# EAGLE board tarjeta-v7 (EAGLE 6.4)
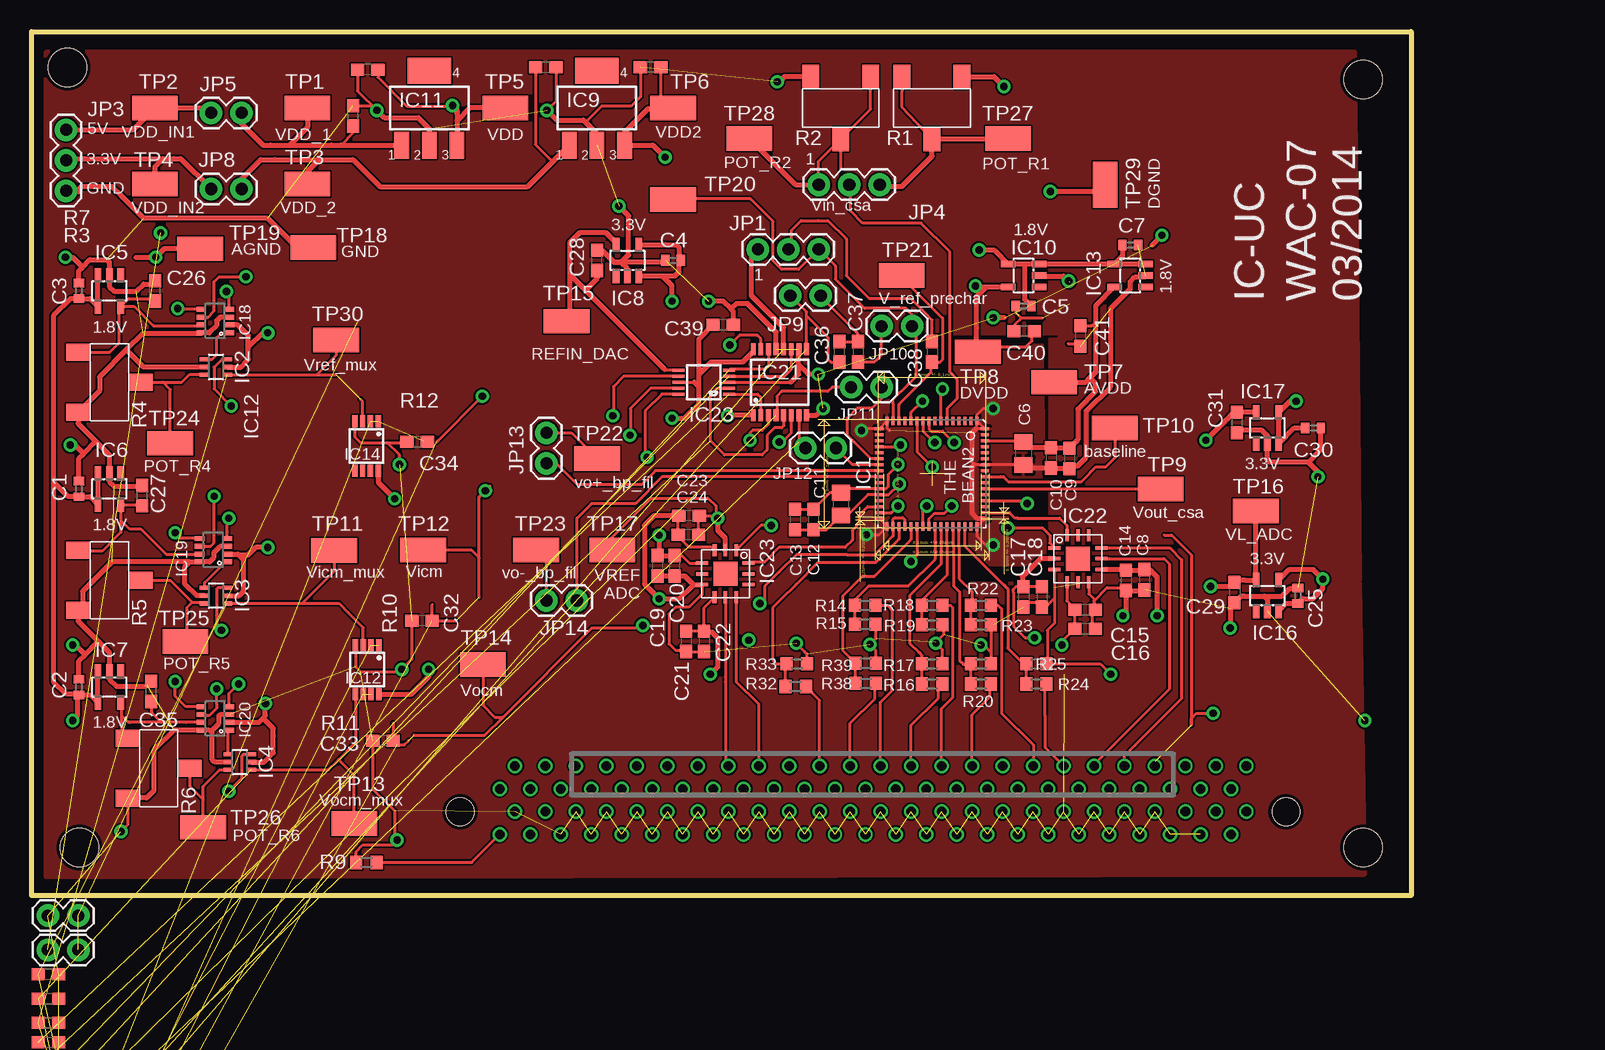
[diagram p5: board, top side]
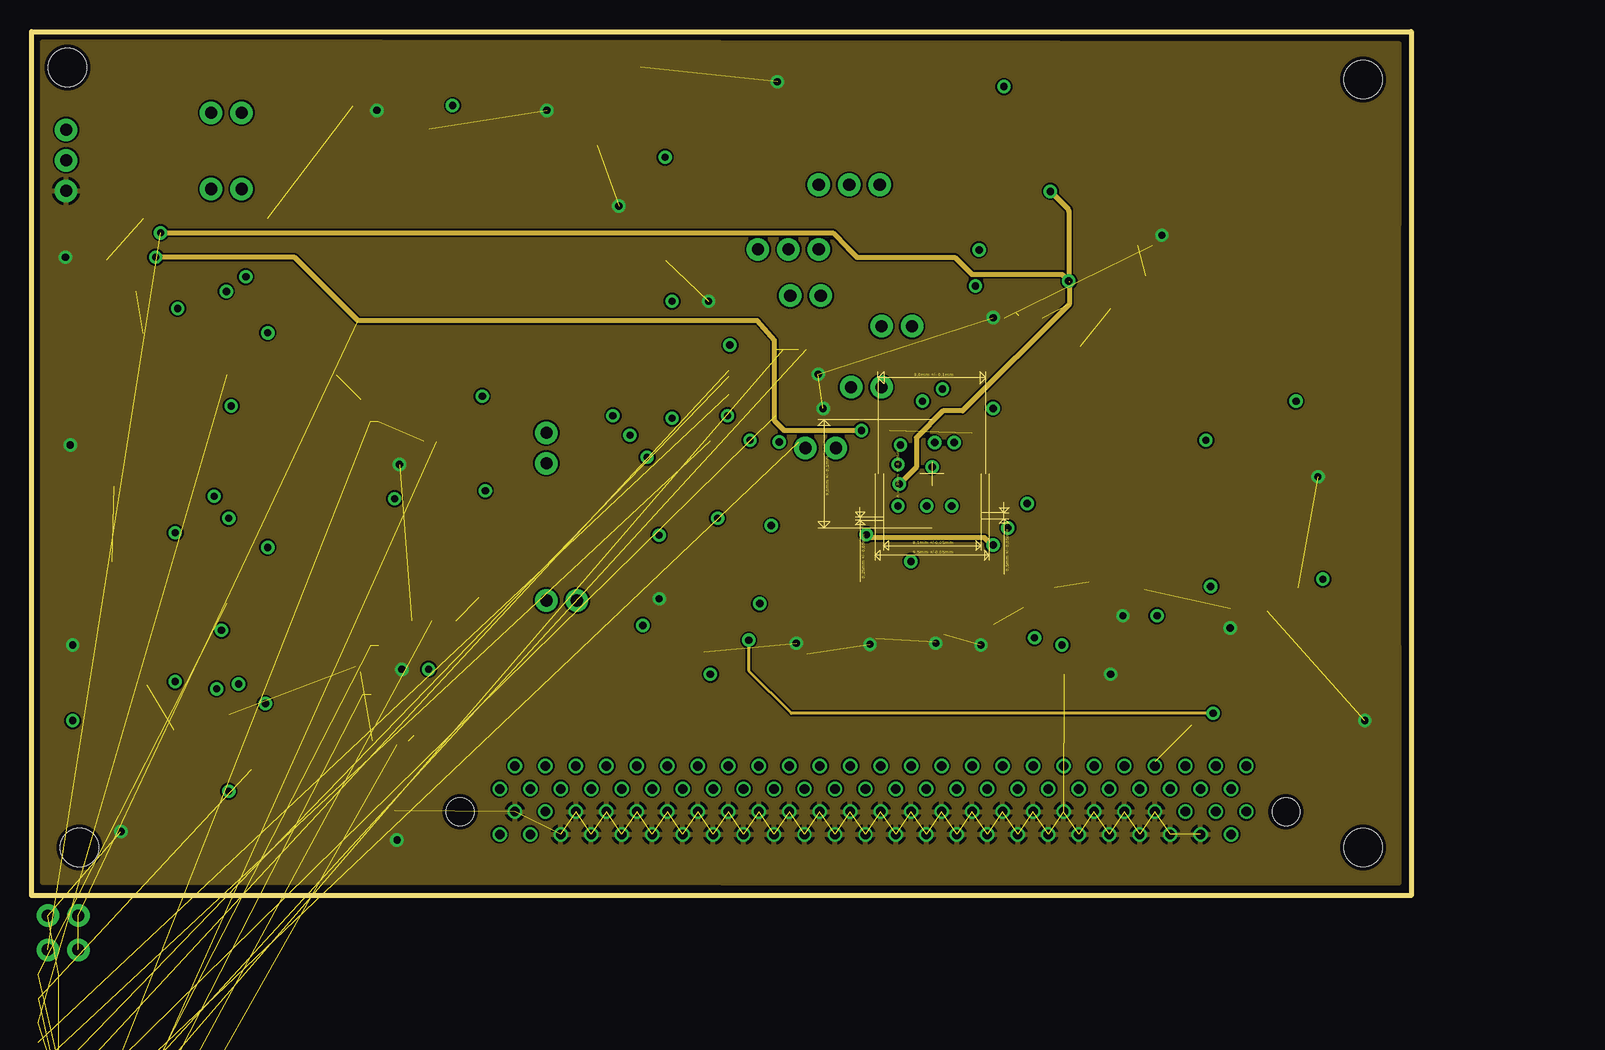
[diagram p6: board, inner layer Route2]
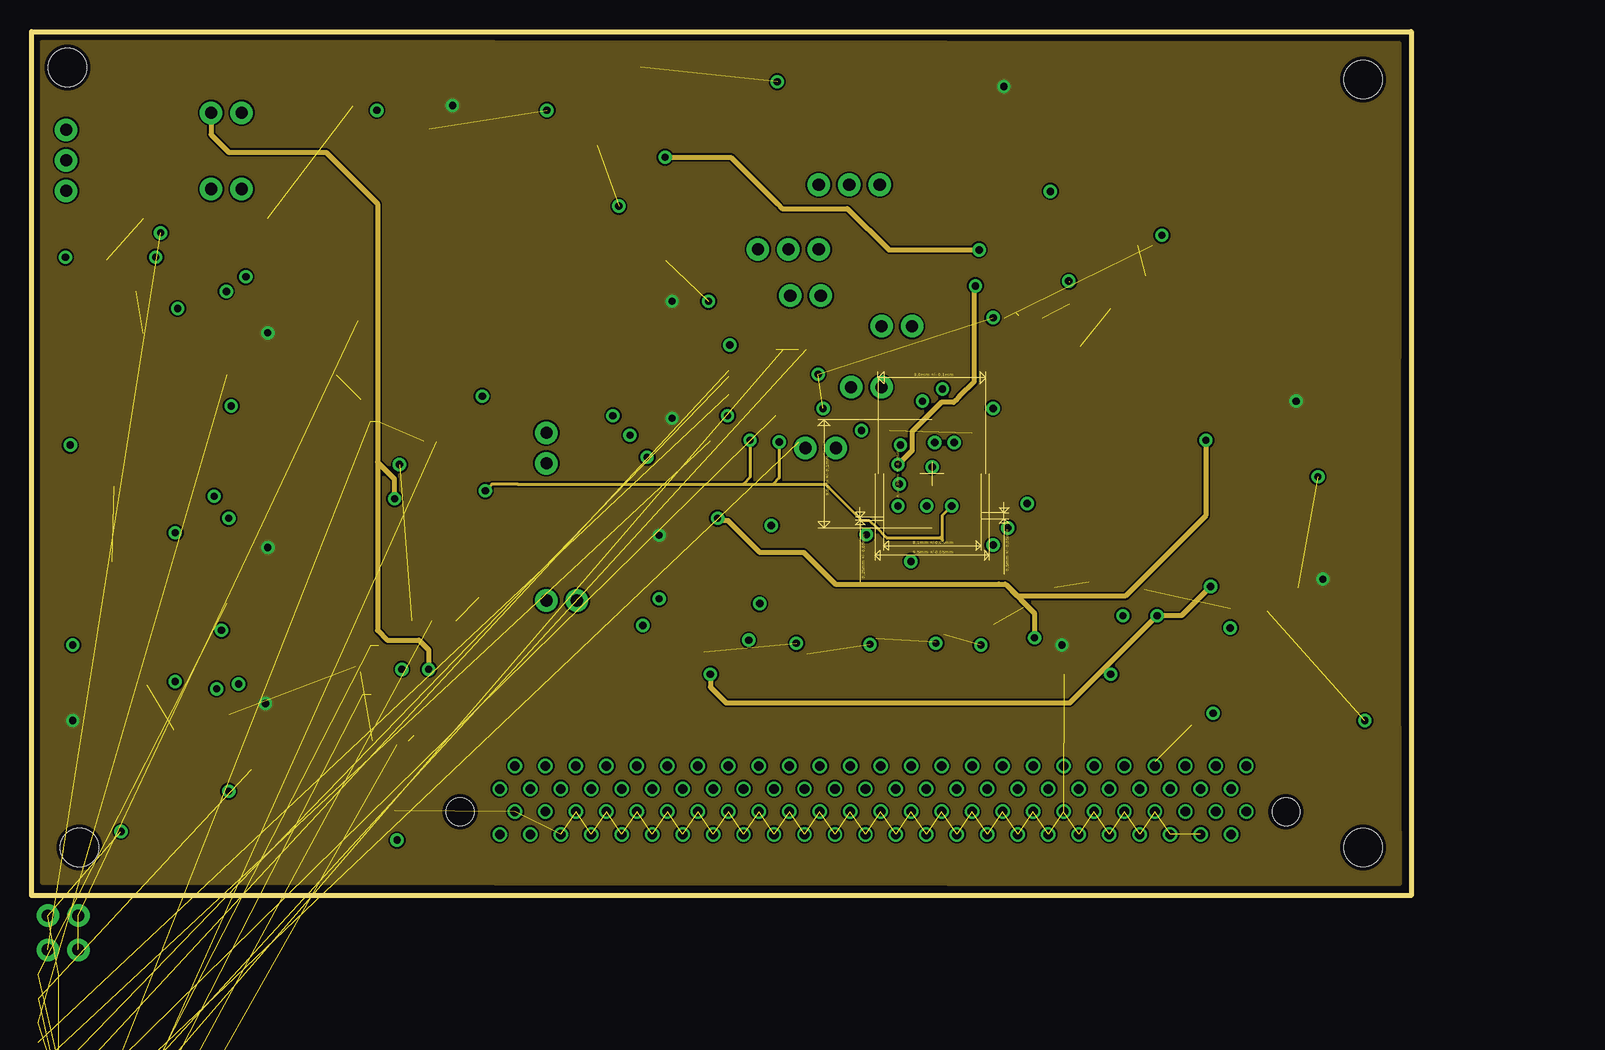
[diagram p7: board, inner layer Route3]
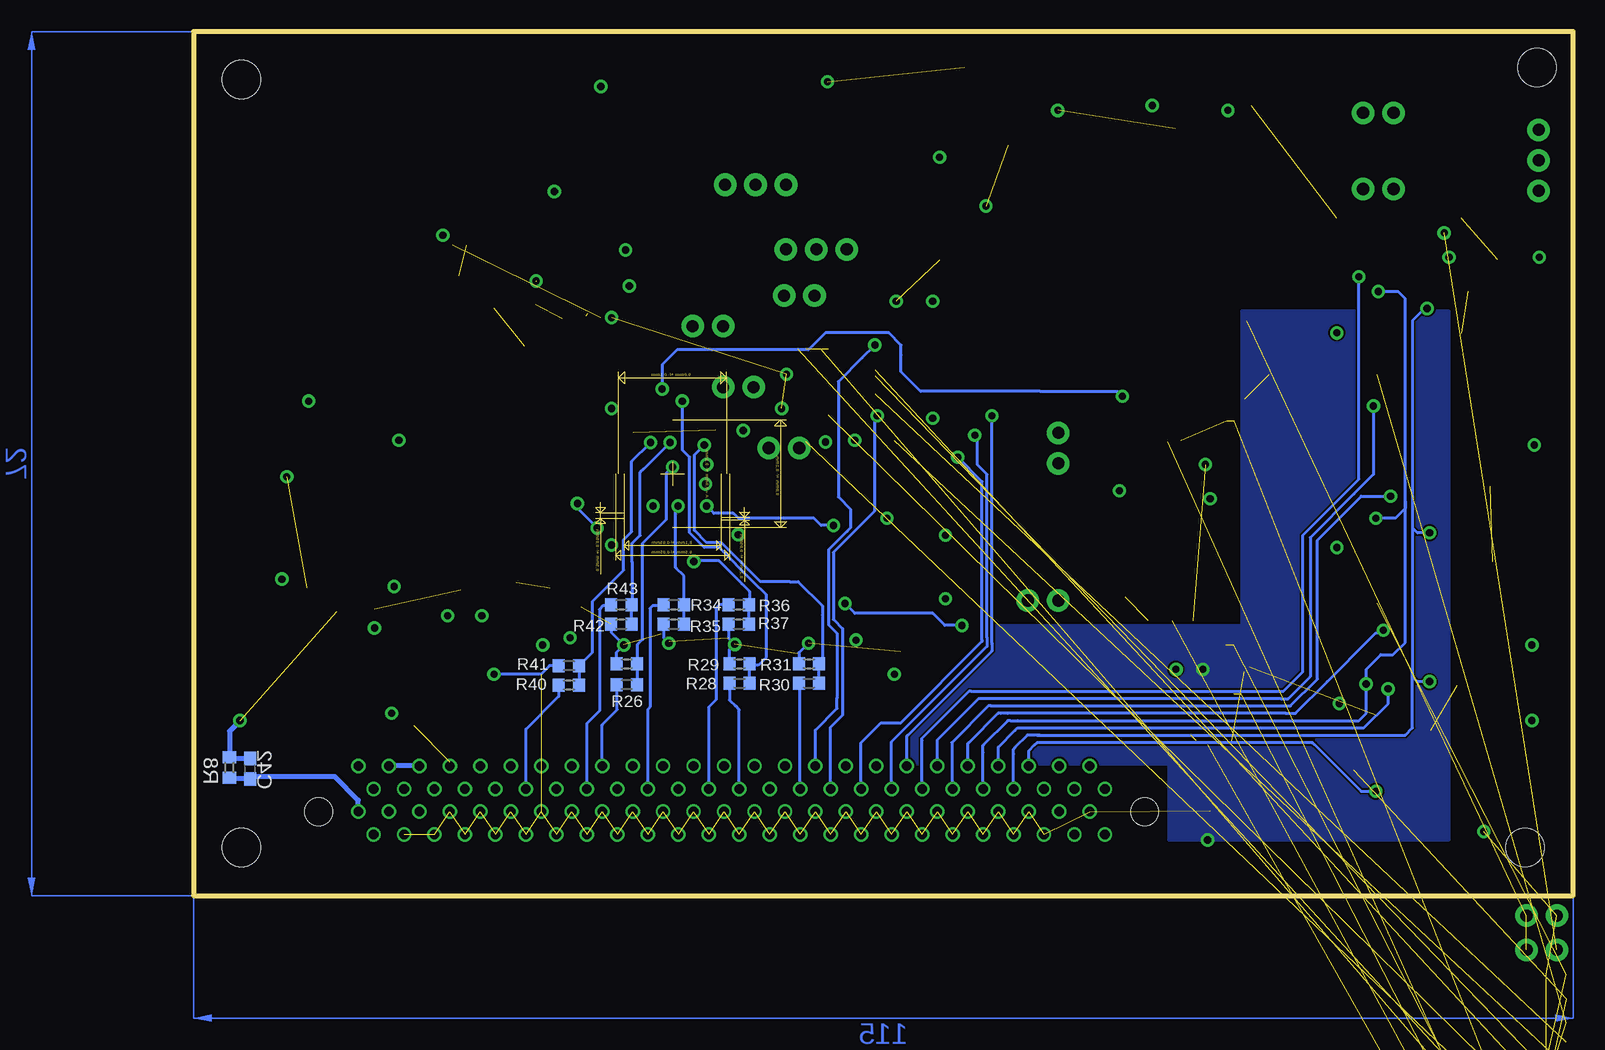
[diagram p8: board, bottom side, seen from below]

Size 115 x 72 mm. Coordinates in mm from the lower left corner, seen from the top.
Outline: 0,0 0,72 115,72 115,0 0,0
Copper layers [2:(1*2*3*16):3]: Top 0.035mm / dielectric 0.2mm / Route2 0.035mm / dielectric 0.8mm / Route3 0.035mm / dielectric 0.2mm / Bottom 0.035mm
Design rules "Reglas *": minimum track width 8mil, minimum drill 20mil, track to track 6mil, track to pad 6mil, pad to pad 6mil, via to via 6mil, smd to smd 6mil, copper to edge 12mil, drill to drill 8mil, minimum pad ring 6mil, minimum via ring 10mil, stop-mask expansion 4mil, vias tented up to drill 25mil, thermal gap 10mil
Holes 3.2 mm at 111,4 111,68 3,69 4,4

## Footprints (pad centres in the part's own frame; a part is rotated, then mirrored left to right if it is on the bottom)
C0402 = smd 0.7 x 0.9: 1 -0.65,0; 2 0.65,0
C0805 = smd 1.3 x 1.5: 1 -0.95,0; 2 0.95,0
C0603 = smd 1.1 x 1: 1 -0.85,0; 2 0.85,0
QFN64 = smd 0.7 x 0.25: 1 -14.56,5.02; 2 -14.56,4.52; 3 -14.56,4.02; 4 -14.56,3.52; 5 -14.56,3.02; 6 -14.56,2.52; 7 -14.56,2.02; 8 -14.56,1.52; 9 -14.56,1.02; 10 -14.56,0.52; 11 -14.56,0.02; 12 -14.56,-0.48; 13 -14.56,-0.98; 14 -14.56,-1.48; 15 -14.56,-1.98; 16 -14.56,-2.48; 33 -5.76,-2.48; 34 -5.76,-1.98; 35 -5.76,-1.48; 36 -5.76,-0.98; 37 -5.76,-0.48; 38 -5.76,0.02; 39 -5.76,0.52; 40 -5.76,1.02; 41 -5.76,1.52; 42 -5.76,2.02; 43 -5.76,2.52; 44 -5.76,3.02; 45 -5.76,3.52; 46 -5.76,4.02; 47 -5.76,4.52; 48 -5.76,5.02 | smd 0.25 x 0.7: 17 -13.91,-3.13; 18 -13.41,-3.13; 19 -12.91,-3.13; 20 -12.41,-3.13; 21 -11.91,-3.13; 22 -11.41,-3.13; 23 -10.91,-3.13; 24 -10.41,-3.13; 25 -9.91,-3.13; 26 -9.41,-3.13; 27 -8.91,-3.13; 28 -8.41,-3.13; 29 -7.91,-3.13; 30 -7.41,-3.13; 31 -6.91,-3.13; 32 -6.41,-3.13; 49 -6.41,5.67; 50 -6.91,5.67; 51 -7.41,5.67; 52 -7.91,5.67; 53 -8.41,5.67; 54 -8.91,5.67; 55 -9.41,5.67; 56 -9.91,5.67; 57 -10.41,5.67; 58 -10.91,5.67; 59 -11.41,5.67; 60 -11.91,5.67; 61 -12.41,5.67; 62 -12.91,5.67; 63 -13.41,5.67; 64 -13.91,5.67
SC70 = smd 0.35 x 0.8: 1 -0.65,-0.95; 2 0,-0.95; 3 0.65,-0.95; 4 0.65,0.95; 5 0,0.95; 6 -0.65,0.95
SOT23-5L_2 = smd 0.55 x 1.2: 1 -0.95,-1.3; 2 0,-1.3; 3 0.95,-1.3; 4 0.95,1.3; 5 -0.95,1.3
SOT223 = smd 1.219 x 2.235: 1 -2.311,-3.099; 2 0,-3.099; 3 2.311,-3.099 | smd 3.6 x 2.2: 4 0,3.099
MSOP8 = smd 0.45 x 1: 1 -1.175,-1.875; 2 -0.525,-1.875; 3 0.125,-1.875; 4 0.775,-1.875; 5 0.775,2.225; 6 0.125,2.225; 7 -0.525,2.225; 8 -1.175,2.225
SOT23-8_2 = smd 0.406 x 0.813: 1 -1,-1.04; 2 -0.35,-1.04; 3 0.3,-1.04; 4 0.95,-1.04; 5 0.95,1.26; 6 0.3,1.26; 7 -0.35,1.26; 8 -1,1.26
QSOP16 = smd 0.4 x 1: 1 -2.223,-2.75; 2 -1.588,-2.75; 3 -0.953,-2.75; 4 -0.318,-2.75; 5 0.318,-2.75; 6 0.953,-2.75; 7 1.588,-2.75; 8 2.223,-2.75; 9 2.223,2.75; 10 1.588,2.75; 11 0.953,2.75; 12 0.318,2.75; 13 -0.318,2.75; 14 -0.953,2.75; 15 -1.588,2.75; 16 -2.223,2.75
TQFN12 = smd 1 x 0.3: P$1 0.05,-1.1; P$2 0.05,-2; P$3 0.05,-2.9; P$7 3.95,-2.9; P$8 3.95,-2; P$9 3.95,-1.1 | smd 0.3 x 1: P$4 1.1,-3.95; P$5 2,-3.95; P$6 2.9,-3.95; P$10 2.9,-0.05; P$11 2,-0.05; P$12 1.1,-0.05 | smd 2 x 2: P$13 2,-2
MSOP10 = smd 0.25 x 1: 1 -1,-2.113; 2 -0.5,-2.113; 3 0,-2.113; 4 0.5,-2.113; 5 1,-2.113; 6 1,2.113; 7 0.5,2.113; 8 0,2.113; 9 -0.5,2.113; 10 -1,2.113
FX2-100S-1.27 = drill 0.8: A1 0,0; A2 -1.27,-1.905; A3 -2.54,0; A4 -3.81,-1.905; A5 -5.08,0; A6 -6.35,-1.905; A7 -7.62,0; A8 -8.89,-1.905; A9 -10.16,0; A10 -11.43,-1.905; A11 -12.7,0; A12 -13.97,-1.905; A13 -15.24,0; A14 -16.51,-1.905; A15 -17.78,0; A16 -19.05,-1.905; A17 -20.32,0; A18 -21.59,-1.905; A19 -22.86,0; A20 -24.13,-1.905; A21 -25.4,0; A22 -26.67,-1.905; A23 -27.94,0; A24 -29.21,-1.905; A25 -30.48,0; A26 -31.75,-1.905; A27 -33.02,0; A28 -34.29,-1.905; A29 -35.56,0; A30 -36.83,-1.905; A31 -38.1,0; A32 -39.37,-1.905; A33 -40.64,0; A34 -41.91,-1.905; A35 -43.18,0; A36 -44.45,-1.905; A37 -45.72,0; A38 -46.99,-1.905; A39 -48.26,0; A40 -49.53,-1.905; A41 -50.8,0; A42 -52.07,-1.905; A43 -53.34,0; A44 -54.61,-1.905; A45 -55.88,0; A46 -57.15,-1.905; A47 -58.42,0; A48 -59.69,-1.905; A49 -60.96,0; A50 -62.23,-1.905; B1 0,3.8; B2 -1.27,1.895; B3 -2.54,3.8; B4 -3.81,1.895; B5 -5.08,3.8; B6 -6.35,1.895; B7 -7.62,3.8; B8 -8.89,1.895; B9 -10.16,3.8; B10 -11.43,1.895; B11 -12.7,3.8; B12 -13.97,1.895; B13 -15.24,3.8; B14 -16.51,1.895; B15 -17.78,3.8; B16 -19.05,1.895; B17 -20.32,3.8; B18 -21.59,1.895; B19 -22.86,3.8; B20 -24.13,1.895; B21 -25.4,3.8; B22 -26.67,1.895; B23 -27.94,3.8; B24 -29.21,1.895; B25 -30.48,3.8; B26 -31.75,1.895; B27 -33.02,3.8; B28 -34.29,1.895; B29 -35.56,3.8; B30 -36.83,1.895; B31 -38.1,3.8; B32 -39.37,1.895; B33 -40.64,3.8; B34 -41.91,1.895; B35 -43.18,3.8; B36 -44.45,1.895; B37 -45.72,3.8; B38 -46.99,1.895; B39 -48.26,3.8; B40 -49.53,1.895; B41 -50.8,3.8; B42 -52.07,1.895; B43 -53.34,3.8; B44 -54.61,1.895; B45 -55.88,3.8; B46 -57.15,1.895; B47 -58.42,3.8; B48 -59.69,1.895; B49 -60.96,3.8; B50 -62.23,1.895 | hole 2.3: -65.54,1.905; 3.31,1.905
1X03 = drill 1.016 pad 1.88: 1 -2.54,0; 2 0,0; 3 2.54,0
1X02 = drill 1.016 pad 1.88: 1 -1.27,0; 2 1.27,0
ST-5EW = smd 1.4 x 2: 1 -2.5,-2.6; 2 0,2.6; 3 2.5,-2.6
R0603 = smd 1 x 1.1: 1 -0.85,0; 2 0.85,0
TP = smd 3.81 x 2.032: TP 0,0

## Placement (x,y rotation side)
C1  [C0402]  3.95,33.89 90 top
C2  4.7uf  [C0402]  3.95,17.38 90 top
C3  [C0402]  3.95,50.4 90 top
C4  4.7uf  [C0402]  53.49,52.94 180 top
C5  [C0402]  82.7,49.13 180 top
C6  [C0805]  82.7,36.83 270 top
C7  [C0402]  91.59,54.21 0 top
C8  CAP_0603  [C0603]  92.75,26.32 270 top
C9  CAP_0603  [C0603]  86.51,36.43 270 top
C10  CAP_0603  [C0603]  84.98,36.48 270 top
C11  [C0805]  67.46,32.62 270 top
C12  CAP_0603  [C0603]  65.17,31.35 270 top
C13  CAP_0603  [C0603]  63.65,31.35 270 top
C14  CAP_0603  [C0603]  91.23,26.27 270 top
C15  CAP_0603  [C0603]  87.83,23.83 0 top
C16  CAP_0603  [C0603]  87.83,22.25 0 top
C17  CAP_0603  [C0603]  82.7,24.89 270 top
C18  CAP_0603  [C0603]  84.22,24.89 270 top
C19  CAP_0603  [C0603]  52.17,27.49 270 top
C20  CAP_0603  [C0603]  53.59,27.49 270 top
C21  CAP_0603  [C0603]  54.55,21.19 270 top
C22  CAP_0603  [C0603]  56.08,21.19 270 top
C23  CAP_0603  [C0603]  54.81,31.65 180 top
C24  CAP_0603  [C0603]  54.76,30.08 180 top
C25  [C0402]  105.56,25 90 top
C26  CAP_0603  [C0603]  10.3,50.4 90 top
C27  CAP_0603  [C0603]  9.23,33.33 90 top
C28  0.1uf  [C0603]  47.14,52.94 90 top
C29  0.1uf  [C0603]  100.27,25.25 270 top
C30  4.7uf  [C0402]  106.83,38.97 0 top
C31  0.1uf  [C0603]  100.48,39.42 270 top
C32  CAP_0603  [C0603]  32.55,22.91 180 top
C33  CAP_0603  [C0603]  29.3,12.91 180 top
C34  4.7uf  [C0603]  32.14,37.8 180 top
C35  0.1uf  [C0603]  9.99,17.02 90 top
C36  CAP_0603  [C0603]  67.35,45.32 90 top
C37  CAP_0603  [C0603]  68.88,45.32 270 top
C38  CAP_0603  [C0603]  75.08,45.32 270 top
C39  0.1uF  [C0603]  57.65,47.55 180 top
C40  CAP_0603  [C0603]  82.75,47.04 180 top
C41  CAP_0603  [C0603]  87.42,46.64 270 top
C42  1nf  [C0603]  110.28,10.57 90 bottom
C43  CAP_0603  [C0603]  26.81,64.98 90 top
C44  CAP_0603  [C0603]  28.03,68.84 180 top
C45  CAP_0603  [C0603]  42.86,69.04 0 top
C46  CAP_0603  [C0603]  51.6,69.04 180 top
C47  CAP_0603  [C0603]  1.41,-6.55 0 top  (outside the outline)
C48  CAP_0603  [C0603]  1.41,-8.58 0 top  (outside the outline)
C49  CAP_0603  [C0603]  1.41,-10.61 0 top  (outside the outline)
C50  CAP_0603  [C0603]  1.41,-12.24 0 top  (outside the outline)
C51  CAP_0603  [C0603]  1.41,-14.27 0 top  (outside the outline)
C52  CAP_0603  [C0603]  1.41,-16.3 0 top  (outside the outline)
C53  CAP_0603  [C0603]  1.41,-18.34 0 top  (outside the outline)
C54  CAP_0603  [C0603]  1.41,-20.37 0 top  (outside the outline)
C55  CAP_0603  [C0603]  1.41,-22.4 0 top  (outside the outline)
C56  CAP_0603  [C0603]  1.41,-24.43 0 top  (outside the outline)
C57  CAP_0603  [C0603]  1.41,-26.46 0 top  (outside the outline)
IC1  THE_BEAN_2  [QFN64]  73.81,25 270 top
IC2  [SC70]  15.38,44.05 270 top
IC3  [SC70]  15.38,25 270 top
IC4  [SC70]  17.36,11.13 270 top
IC5  1.8V  [SOT23-5L_2]  6.49,50.4 180 top
IC6  1.8V  [SOT23-5L_2]  6.49,33.89 180 top
IC7  1.8V  [SOT23-5L_2]  6.49,17.38 180 top
IC8  1.8V  [SOT23-5L_2]  49.68,52.94 0 top
IC9  [SOT223]  47.13,65.64 0 top
IC10  1.8  [SOT23-5L_2]  82.7,51.67 90 top
IC11  [SOT223]  33.16,65.64 0 top
IC12  OP282  [MSOP8]  27.77,19 180 top
IC13  1.8  [SOT23-5L_2]  91.59,51.67 90 top
IC14  OP282  [MSOP8]  27.72,37.65 180 top
IC16  1.8V  [SOT23-5L_2]  103.02,25 0 top
IC17  1.8V  [SOT23-5L_2]  103.02,38.97 0 top
IC18  AD5160_2  [SOT23-8_2]  15.43,47.91 90 top
IC19  AD5160_2  [SOT23-8_2]  15.27,28.81 90 top
IC20  AD5160_2  [SOT23-8_2]  15.43,14.79 90 top
IC21  [QSOP16]  62.38,42.78 0 top
IC22  [TQFN12]  85.24,30.08 0 top
IC23  DAC7554  [MSOP10]  56.03,42.78 90 top
J1  HIRESO_FX_CONNECTOR  [FX2-100S-1.27]  39.03,8.89 180 top
JP1  JUMPER03  [1X03]  63.09,53.85 0 top
JP2  JUMPER02  [1X02]  2.63,-1.67 0 top
JP3  JUMPER03  [1X03]  2.88,61.27 90 top
JP4  JUMPER03  [1X03]  68.16,59.24 0 top
JP5  JUMPER02  [1X02]  16.24,65.23 180 top
JP6  JUMPER02  [1X02]  2.63,-4.52 0 top  (outside the outline)
JP7  JUMPER03  [1X03]  3.84,-28.9 0 top  (outside the outline)
JP8  JUMPER02  [1X02]  16.24,58.88 180 top
JP9  JUMPER02  [1X02]  64.51,49.99 0 top
JP10  JUMPER02  [1X02]  72.13,47.45 0 top
JP11  JUMPER02  [1X02]  69.59,42.37 0 top
JP12  JUMPER02  [1X02]  65.78,37.29 0 top
JP13  JUMPER02  [1X02]  42.92,37.29 90 top
JP14  JUMPER02  [1X02]  44.19,24.59 180 top
JP15  JUMPER03  [1X03]  3.84,-31.75 0 top  (outside the outline)
JP16  JUMPER03  [1X03]  3.84,-34.59 0 top  (outside the outline)
R1  [ST-5EW]  75.07,65.64 180 top
R2  [ST-5EW]  67.45,65.64 180 top
R4  [ST-5EW]  6.49,42.78 270 top
R5  [ST-5EW]  6.49,26.27 270 top
R6  [ST-5EW]  10.6,10.62 270 top
R8  1M  [R0603]  112.01,10.67 270 bottom
R9  RES_0603  [R0603]  27.92,2.76 0 top
R14  RES_0603  [R0603]  69.49,24.18 0 top
R15  RES_0603  [R0603]  69.49,22.61 180 top
R16  RES_0603  [R0603]  75.08,17.63 0 top
R17  RES_0603  [R0603]  75.08,19.31 180 top
R18  RES_0603  [R0603]  75.08,24.18 0 top
R19  RES_0603  [R0603]  75.08,22.56 180 top
R20  RES_0603  [R0603]  79.14,17.63 0 top
R21  RES_0603  [R0603]  79.14,19.31 180 top
R22  RES_0603  [R0603]  79.14,24.18 0 top
R23  RES_0603  [R0603]  79.14,22.56 180 top
R24  RES_0603  [R0603]  83.76,17.63 0 top
R25  RES_0603  [R0603]  83.76,19.31 180 top
R26  RES_0603  [R0603]  78.89,17.58 180 bottom
R27  RES_0603  [R0603]  78.89,19.31 0 bottom
R28  RES_0603  [R0603]  69.49,17.68 180 bottom
R29  RES_0603  [R0603]  69.49,19.31 0 bottom
R30  RES_0603  [R0603]  63.7,17.68 180 bottom
R31  RES_0603  [R0603]  63.7,19.31 0 bottom
R32  RES_0603  [R0603]  63.7,17.43 0 top
R33  RES_0603  [R0603]  63.8,19.31 180 top
R34  0  [R0603]  74.97,24.23 180 bottom
R35  0  [R0603]  74.97,22.61 0 bottom
R36  RES_0603  [R0603]  69.54,24.23 180 bottom
R37  RES_0603  [R0603]  69.54,22.61 0 bottom
R38  RES_0603  [R0603]  69.54,17.68 0 top
R39  RES_0603  [R0603]  69.54,19.36 180 top
R40  RES_0603  [R0603]  83.71,17.53 180 bottom
R41  RES_0603  [R0603]  83.71,19.15 0 bottom
R42  RES_0603  [R0603]  79.34,24.23 180 bottom
R43  RES_0603  [R0603]  79.34,22.61 0 bottom
TP1  [TP]  23,65.64 0 top
TP2  [TP]  10.3,65.64 0 top
TP3  [TP]  23,59.29 0 top
TP4  [TP]  10.3,59.29 0 top
TP5  [TP]  39.51,65.64 0 top
TP6  [TP]  53.48,65.64 0 top
TP7  [TP]  85.24,42.78 0 top
TP8  [TP]  78.89,45.32 0 top
TP9  [TP]  94.13,33.89 0 top
TP10  [TP]  90.32,38.97 0 top
TP11  [TP]  25.23,28.76 0 top
TP12  [TP]  32.65,28.81 0 top
TP13  [TP]  26.91,6 0 top
TP14  [TP]  37.63,19.26 0 top
TP15  [TP]  44.6,47.86 0 top
TP16  [TP]  102.05,32.06 0 top
TP17  [TP]  48.41,28.81 0 top
TP18  [TP]  23.5,54 180 top
TP19  [TP]  14.06,53.9 0 top
TP20  [TP]  53.48,58.02 0 top
TP21  [TP]  72.54,51.67 0 top
TP22  [TP]  47.14,36.43 0 top
TP23  [TP]  42.06,28.81 0 top
TP24  [TP]  11.57,37.7 0 top
TP25  [TP]  12.84,21.19 0 top
TP26  [TP]  14.31,5.69 0 top
TP27  [TP]  81.42,63.1 0 top
TP28  [TP]  59.83,63.1 0 top
TP29  [TP]  89.49,59.24 90 top
TP30  [TP]  25.38,46.28 0 top
TP31  [TP]  1.81,-37.23 0 top  (outside the outline)
TP32  [TP]  1.81,-39.47 0 top  (outside the outline)
TP33  [TP]  1.81,-41.7 0 top  (outside the outline)
TP34  [TP]  1.81,-43.94 0 top  (outside the outline)
TP35  [TP]  1.81,-46.17 0 top  (outside the outline)
TP36  [TP]  1.81,-48.41 0 top  (outside the outline)
U$5  [TQFN12]  59.84,28.81 270 top

## Tracks (layer width: path | path; a pad name or v marks a point on that pad's centre or on a via)
!CS_ADC1
  Top 0.254: IC22.P$9 94.87,28.98 95.85,27.99 95.85,19.31 95.85,16.41 92.03,12.55 91.1,11.62 J1.A42
!CS_ADC2
  Top 0.254: U$5.P$9 58.74,18.12 58.74,17.83 60.62,15.95 J1.A18
!CS_DAC  (via drill 0.6)
  Top 0.254: IC23.7 49.36,43.28 48.51,42.42 48.51,40.03 v48.46,39.98
  Bottom 0.254: v48.46,39.98 48.46,21.09 48.46,20.97 48.46,20.36 55.46,13.36 55.54,13.28 55.54,12.26 J1.A14
AGND  (via drill 0.6)  (5 unrouted)
  Top 0.254: 82.8,35.78 C6.2 79.91,35.88 79.5,35.88 IC1.58 79.46,35.92 79.19,35.92 78.99,35.92 78.58,35.92 78.38,36.12 78.38,36.53 | IC1.32 IC1.33 70.65,30.08 v69.59,30.08 | v80.16,40.59 79.34,40.59 78.83,40.08 IC1.1 IC1.64 78.72,38.91 | v69.18,38.76 69.33,38.91 IC1.17 IC1.16 71.33,38.95 71.51,38.76 | IC1.49 IC1.48 78.83,29.93 79.55,29.21 v80.16,29.21 | 86.31,35.78 C9.2 | 86.39,45.99 87.09,45.99 arc-45 87.31,45.89 C41.2
  Top 0.406: IC13.2 92.78,51.56 91.99,51.56 91.59,51.16 91.59,50.55 89.96,48.92 89.96,42.42 87.93,40.39 87.93,36.53 87.18,35.78 86.71,35.78 C9.2 86.46,35.63 C10.2 82.95,35.63 C6.2 | 78.72,38.91 78.38,38.56 78.38,36.53 | 8.72,53.19 v10.35,53.19 11.06,53.9 TP19.TP | IC1.49 78.87,31.41 78.42,31.85 78.42,35.76 78.58,35.92
  Route2 0.406: v10.35,53.19 21.93,53.19 27.21,47.91 60.5,47.91 61.92,46.28 61.92,39.58 62.73,38.76 v69.18,38.76 | v69.59,30.08 69.64,30.03 69.68,30.03 69.89,29.82 79.44,29.82 80.05,29.21 v80.16,29.21
  pour Top: 65.62,45.88 65.62,27.59 84.52,27.59 84.52,27.99 84.31,45.88
AVDD
  Top 0.254: IC1.62 82.57,37.91 C6.1 | 86.31,37.08 C9.1 | C41.1 88.29,47.49 arc45 88.52,47.58 88.74,47.81
  Top 0.406: TP7.TP 87.88,42.78 88.23,43.13 | 88.23,43.13 88.74,43.64 88.74,47.5 88.74,47.81 88.74,49.17 IC13.5 | C6.1 83.15,37.33 84.12,37.33 C10.1 85.03,37.28 C9.1 87.22,37.99 87.22,40.54 88.69,42.01 88.69,42.67 88.23,43.13
BASELINE
  Top 0.254: IC1.56 80.77,34.9 81.02,34.9 81.43,34.5 87.52,34.5 87.73,34.7 88.74,35.72 89.55,35.72 90.37,36.53 90.37,38.92 TP10.TP
CAP_PRECHAR
  Top 0.254: C38.2 75.29,44.67 | IC1.14 72.33,40.89 72.33,40.94 74.97,43.59 74.97,44.37 C38.2 | TP21.TP 72.54,51.51 75.94,48.11 75.94,44.66 75.69,44.4 75.14,44.4 C38.2
CAP_PRECHAR_1  (1 unrouted)
  Top 0.406: IC21.12 62.69,47.34 59.99,50.04 59.99,53.29 JP1.1
CLK  (via drill 0.6)
  Top 0.254: IC1.20 72.3,37.41 v72.44,37.54
  Bottom 0.254: v72.44,37.54 73.25,36.73 73.25,30.43 72.23,29.42 71.01,29.42 67.76,26.16 65.32,26.16 64.61,26.16 62.58,24.13 62.58,23.37 62.58,19.62 R31.2 | 63.1,19.31 R31.2 | R30.1 R31.2
CLK_ADC  (via drill 0.6)  (1 unrouted)
  Top 0.254: 94.43,30.03 95.04,30.03 96.67,28.4 96.67,14.18 96.67,14.74 97.11,15.19 v98.5,15.19 | J1.A44 93.64,11.15
  Route2 0.254: v98.5,15.19 63.34,15.19 59.79,18.75 v59.79,21.29
CLK_ADC2
  Top 0.254: U$5.P$10
CLK_DAC  (via drill 0.6)
  Top 0.254: IC23.10 52.54,41.78 51.15,40.39 51.15,36.68 v51.3,36.53
  Bottom 0.254: v51.3,36.53 49.27,34.5 49.27,21.29 49.27,21.18 56.07,14.38 57.73,14.38 57.81,14.29 59.35,12.75 J1.A17
CLK_PRECH1  (via drill 0.6)
  Top 0.254: IC1.9 74.83,38.86 74.97,38.71 75.94,38.71 v76.91,37.75
  Bottom 0.254: v76.91,37.75 78.48,36.17 78.48,30.33 79.14,29.67 79.14,27.13 81.54,24.73 81.78,24.49 81.78,20.23 R41.2 R40.1
CLK_PRECH1_T
  Bottom 0.254: R40.2 84.56,16.6 87.29,13.87 J1.A39
CLK_PRECH2  (via drill 0.6)
  Top 0.254: IC1.10 74.33,38.7 v75.28,37.75
  Bottom 0.254: v75.28,37.75 77.46,35.56 77.77,35.26 77.77,30.03 78.44,29.36 78.44,27.78 78.44,24.29 R42.1 R43.2
CLK_PRECH2_T
  Bottom 0.254: R42.2 80.26,24.17 80.26,24.13 80.87,24.13 81.17,23.83 81.17,15.39 82.21,14.35 J1.A35
CLK_REF  (via drill 0.6)
  Top 0.254: 16.42,29.86 IC19.4 16.31,30.3 16.31,31.32 v16.44,31.45 | IC20.4 16.47,15.83 16.47,16.84 v17.26,17.63 | IC18.4 16.47,50.12 v16.24,50.35
  Bottom 0.254: 14.01,32.87 14.01,33.48 | 14.01,33.48 14.01,49.53 14.01,49.74 14.61,50.35 v16.24,50.35 | 14.01,32.87 14.01,21.09 15.02,20.07 16.04,20.07 17.26,18.85 v17.26,17.63 17.26,15.19 17.87,14.58 46.31,14.58 46.92,14.58 47.13,14.58 49.16,12.55 49.19,12.52 49.19,11.91 J1.A9 | 14.01,32.87 14.01,33.48 | 14.01,32.87 14.01,32.26 14.82,31.45 v16.44,31.45
CLK_T
  Bottom 0.254: 64.4,17.48 R30.2 64.43,17.57 J1.A21
CS_B0
  Top 0.254: R15.2 R14.1 68.64,24.65 69.3,25.31 69.79,25.81 73.09,25.81 75.33,28.04 IC1.41
CS_B0_T
  Top 0.254: R14.2 70.65,24.13 71.42,24.13 71.72,23.83 71.72,18.04 71.72,17.07 70.81,16.16 70.78,16.13 J1.A26
CS_B1
  Top 0.254: R16.1 R17.2 74.23,20 73.96,20.27 73.2,21.03 73.2,25 73.3,25.1 75.64,27.43 75.69,27.49 75.83,27.63 IC1.42
CS_B1_T
  Top 0.254: 76.08,17.68 R16.2 75.58,17.29 75.58,16.46 73.32,14.2 J1.A28
CS_B2
  Top 0.254: IC1.43 76.3,30.73 76.3,29.21 76.3,26.67 74.23,24.6 R18.1 R19.2
CS_B2_T
  Top 0.254: R18.2 75.98,24.13 76.65,24.13 76.8,23.98 76.8,16.51 75.86,15.57 J1.A30
CS_B3
  Top 0.254: IC1.44 76.85,30.73 76.85,29.06 76.85,26.06 76.85,25.81 77.26,25.4 77.31,25.35 77.36,25.3 77.36,19.87 77.36,19.56 77.67,19.26 78.24,19.26 R21.2 | R20.1 R21.2 | R21.2 77.92,19.31
CS_B3_T
  Top 0.254: R20.2 79.9,17.54 79.9,16.56 78.4,15.06 J1.A32
CS_B4
  Top 0.254: IC1.45 77.31,30.74 77.31,29.01 77.31,26.42 78.38,25.35 78.38,24.27 R22.1 | R23.2 R22.1 | 78.38,24.25 R22.1
CS_B4_T
  Top 0.254: R22.2 80.26,24.18 80.56,24.18 80.82,23.93 80.87,23.88 80.87,16.17 80.87,15.18 83.5,12.55 83.5,10.81 J1.A36
CS_B5
  Top 0.254: IC1.46 77.82,30.66 77.82,29.11 78.94,27.99 80.74,26.19 81.02,25.91 81.12,25.81 81.22,25.71 81.38,25.55 81.38,20.63 81.78,20.22 82.09,19.92 82.49,19.51 82.76,19.51 R25.2 | 83.06,19.05 R25.2 | R24.1 R25.2
CS_B5_T
  Top 0.254: R24.2 84.47,17.49 84.47,14.99 84.47,12.35 J1.A38
CS_REF_1  (via drill 0.6)
  Top 0.254: IC18.6 14.71,48.21 15.22,48.72 15.22,51.16 15.63,51.56 v17.87,51.56
  Bottom 0.254: J1.A13 54.27,12.92 54.27,13.12 54.24,13.16 50.38,17.02 50.17,17.02 24.16,17.02 22.54,18.65 22.54,30.03 17.87,34.7 v17.87,51.56
CS_REF_2  (via drill 0.6)
  Top 0.254: IC19.6 14.91,29.11 15.22,29.42 v15.22,33.28
  Bottom 0.254: v15.22,33.28 17.66,33.28 21.32,29.62 21.32,18.04 23.55,15.8 23.96,15.8 48.55,15.8 48.75,15.8 51.8,12.75 51.8,8.96 J1.A11
CS_REF_3  (via drill 0.6)
  Top 0.254: v15.43,17.22 15.43,16.01 15.43,15.6 14.82,14.99 14.26,14.99 IC20.6
  Bottom 0.254: J1.A8 47.92,12.36 46.52,13.77 46.31,13.97 17.46,13.97 15.43,16.01 v15.43,17.22
DGND  (via drill 0.6)  (4 unrouted)
  Top 0.254: v72.33,34.29 71.45,33.41 71.34,33.41 IC1.28 69.72,33.41 67.96,31.65 67.47,31.65 C11.2 66.49,30.7 66.29,30.5 C12.2 C13.2 | 82.1,48.52 82.1,49.08 C5.2 | 84.27,48.11 82.5,48.11 | 82.5,48.11 82.3,48.32 | C40.2 81.9,47.37 arc-45 81.99,47.6 82.5,48.11
  Top 0.406: IC10.2 84.05,51.62 86.05,51.62 v86.46,51.21 | 10.5,55.48 v10.75,55.22 | v84.92,58.68 88.94,58.68 TP29.TP
  Route2 0.406: v10.75,55.22 32.5,55.22 55.01,55.22 66.8,55.22 68.02,54 68.83,53.19 76.96,53.19 78.38,51.77 85.9,51.77 v86.46,51.21 86.46,57.05 86.46,57.14 v84.92,58.68 | 86.51,51.16 86.51,49.29 77.61,40.39 75.98,40.39 73.75,38.15 73.75,35.7 v72.33,34.29
DVDD  (via drill 0.6)
  Top 0.254: 64.98,32.06 C12.1 | v72.23,35.92 71.42,35.11 71.42,34.09 71.24,33.91 IC1.27 67.8,33.91 C11.1 67.03,33.57 66.54,33.57 C12.1 | TP8.TP 79.24,45.67 82.85,45.67 83.4,46.22 83.4,46.71 arc-45 83.49,46.94 C40.1 | C13.1 C12.1
  Top 0.406: v78.68,50.8 78.77,50.72 79.6,50.72 | 79.6,50.72 IC10.5 | TP8.TP 78.78,45.32 78.78,47.3 78.78,49.9 79.6,50.72
  Route3 0.406: 78.63,50.8 v78.68,50.8 78.58,50.7 78.58,42.83 77.31,41.56 77.01,41.25 76.85,41.1 75.84,41.1 75.74,41 73.7,38.97 73.4,38.66 73.4,37.09 73.35,37.04 v72.23,35.92
GND  (via drill 0.6, 0.6 pad 1.02)  (87 unrouted)
  Top 0.254: C16.2 88.44,22.46 88.44,23.59 C15.2 | U$5.P$6 55.89,25.06 55.84,25.06 54.81,24.03 53.69,24.03 53.13,23.47 53.13,20.98 53.69,20.42 54.47,20.42 C21.2 C22.2 | IC22.P$6 88.14,25.14 88.54,24.74 88.54,24.54 | 88.54,23.84 C15.2 | 56.89,28.81 U$5.P$3 56.63,29.06 54.81,29.06 54.76,29.06 54.25,29.57 54.25,29.73 C24.2 | 91.55,25.66 C14.2 90.99,25.66 89.66,25.66 88.54,24.54 | IC22.P$3 85.29,25.67 | 14.18,13.77 IC20.8 | IC23.3 63.29,42.78 | 63.95,45.51 IC21.10 | 15.63,14.99 15.73,15.09 | R19.1 76.04,22.77 76.04,21.8 75.38,21.14 v75.38,21.03 75.74,20.68 | 75.94,20.48 75.74,20.68 | v63.75,21.03 64.45,20.33 64.65,20.13 R33.1 | 85.29,25.67 85.29,24.79 84.88,24.39 84.54,24.05 C18.2 84.01,24.39 83.04,24.39 C17.2 | 85.29,25.67 85.29,22.71 84.68,22.1 84.68,19.37 R25.1 89.1,19.31 v89.96,18.44 | v79.14,20.88 79.24,20.98 79.28,20.98 79.99,20.27 | R23.1 79.99,21.07 79.99,20.27 | R17.1 75.93,20.49 75.74,20.68 | R15.1 70.34,21.58 70.34,21.38 v69.89,20.93 70.39,20.44 R39.1 | R6.3 8,5.89 v7.45,5.34 | 88.54,24.54 88.54,23.97 C15.2 | C24.2 54.11,29.76 | C24.2 53.91,31.6 C23.2 | C43.2 28.39,65.83 v28.79,65.43 | v28.79,65.43 29.14,65.08 | C44.2 27.18,67.05 v28.79,65.43 | C45.2 43.71,66.18 v42.96,65.43 | C46.2 50.75,66.56 49.97,65.79 47.53,65.79 46.19,64.44 | R9.1 27.07,3.67 27.62,4.22 30.06,4.22 v30.46,4.63 30.26,4.83 30.26,7.06 28.45,8.88 C33.2 | C32.2 31.7,20.08 31.7,19.68 v30.87,18.85 30.67,18.65 27.42,18.65 27,19.07 IC12.4 | IC14.4 26.95,38.22 27.42,37.75 29.65,37.75 | 29.65,37.75 31.24,37.75 C34.2 | v30.67,35.92 30.67,36.73 29.65,37.75 | 79.99,20.27 R21.1
  Top 0.406: 55.16,25.91 U$5.P$6 | v28.79,65.43 29.14,65.08 29.4,64.82 32.24,64.82 33.16,63.91 IC11.2 | v42.96,65.43 43.77,64.62 46.01,64.62 46.19,64.44 47.13,63.5 IC9.2 | C3.2 3.95,52.07 4.25,52.38 | 4.25,52.38 4.86,52.99 6.28,52.99 6.49,52.78 IC5.2 6.49,50.75 6.89,50.35 8.72,50.35 9.33,50.95 10.01,50.95 C26.2 | 5.37,37.85 3.89,39.33 R4.3 5.67,42.06 5.67,43.23 7.91,45.47 | 5.37,37.85 6.49,36.73 IC6.2 6.49,34.5 6.89,34.09 8.58,34.09 9.14,34.09 C27.2 | C1.2 3.95,36.43 4.35,36.83 | 4.35,36.83 5.37,37.85 | 10.29,18.04 C35.2 9.64,17.52 arc-45 9.42,17.43 8.52,17.43 7.1,17.43 6.49,18.04 IC7.2 6.49,20.27 5.57,21.19 | 5.57,21.19 3.89,22.87 R5.3 4.25,24.13 4.25,25.35 6.71,27.81 13.19,27.81 | C2.2 3.95,19.56 4.45,20.07 | 4.45,20.07 5.57,21.19 | v2.83,53.19 3.44,53.19 4.25,52.38 | 7.91,45.47 9.3,46.86 14.12,46.86 IC18.8 14.18,46.89 14.82,46.89 15.43,47.5 15.43,47.91 15.73,48.21 IC18.3 | IC2.2 9.33,44.05 7.91,45.47 | v3.23,37.54 3.64,37.54 4.35,36.83 | IC3.2 13.75,25 12.79,25.96 12.79,27.4 13.19,27.81 | v3.44,20.88 3.64,20.88 4.45,20.07 | 55.16,25.91 53.99,24.74 v52.32,24.74 51.1,25.96 51.1,30.84 51.61,31.35 51.91,31.65 C23.2 | 102.76,24.95 101.08,24.95 100.95,24.95 arc45 100.72,24.85 C29.2 100.01,24.14 arc45 99.92,23.91 99.92,23.79 v99.92,22.3 | 102.76,24.95 103.02,24.69 IC16.2 | C30.2 107.44,38.93 107.44,37.14 106.42,36.12 | 106.42,36.12 103.17,36.12 102.97,36.33 102.97,37.62 IC17.2 103.02,38.31 102.56,38.76 100.8,38.76 arc45 100.57,38.67 C31.2 | 106.42,36.12 107.23,35.31 v107.23,34.9 | 81.08,48.16 v80.16,48.16 | 93.42,54.21 v94.23,55.02 | R2.3 62.78,68.24 62.37,67.82 v62.16,67.82
  Top 0.406: 49.12,52.78 48.51,52.78 48.51,52.84 48.45,52.89 | IC8.2 49.68,52.23 49.12,52.78 | C4.2 52.68,52.78 48.56,52.78 48.45,52.89 | 13.19,27.81 IC19.8 14.83,27.81 15.22,28.2 15.22,28.6 15.73,29.11 IC19.3 | IC20.3 15.73,15.09 | 14.18,13.77 14.82,13.77 15.02,13.77 15.25,14 | 58.3,48.88 57.65,49.53 v56.43,49.53 | IC21.13 62.06,46.95 59.68,49.33 58.75,49.33 58.3,48.88 | 63.29,42.78 63.95,43.44 63.95,44.25 | 63.95,44.25 63.95,45.51 | v65.58,43.44 64.76,43.44 63.95,44.25 | IC21.8 65.42,40.03 v65.98,40.59 | TP18.TP 22.13,54 19.69,56.44 9.33,56.44 7.5,58.27 6.69,59.08 4.15,59.08 3.79,58.73 | 3.79,58.73 JP3.1 | 3.95,58.64 3.85,58.73 3.79,58.73 | 15.25,14 15.63,14.38 15.63,14.99 | 102.76,24.95 104.24,24.95 104.74,25.45 104.9,25.61 105.52,25.61 C25.2 | IC4.2 15.28,11.13 15.07,11.33 15.07,13.82 15.25,14 | IC20.8 11.89,13.79 10.2,12.09 10.2,8.74 9.59,8.13 8.01,8.13 R6.3 | 48.45,52.89 47.64,53.7 47.22,53.7 C28.2 | C39.1 58.5,48.55 arc45 58.41,48.78 58.3,48.88 | C8.2 92.7,25.42 C14.2 91.23,23.57 v90.98,23.32 | 55.16,25.91 54.44,26.64 C20.2 C19.2 | 49.12,52.78 49.16,52.78 49.77,53.39 49.77,56.65 v48.95,57.46
  Bottom 0.254: 111.91,11.22 R8.1 | R8.1 112.3,11.32 | v63.75,21.03 64.45,20.33 64.55,20.23 R31.1 | R27.1 79.74,20.29 v79.14,20.88 80.19,21.93 R43.1 | R29.1 70.34,20.49 v69.89,20.93 70.39,21.43 R37.1 | R35.1 75.83,21.48 v75.38,21.03 | R41.1 85.34,19.15 85.95,18.55 86.05,18.44 v89.96,18.44 | 111.91,11.42 R8.1
  Bottom 0.406: C42.2 111.91,11.42 | v111.13,14.58 112.01,13.71 R8.1
  pour Route2: 0.89,1.09 114,1.04 113.96,40.71 114.03,70.98 0.9,71.13
  pour Bottom: 10.35,48.72 10.35,4.63 33.72,4.63 33.72,10.92 57.49,10.92 57.49,22.51 27.62,22.51 27.62,48.72
HOLD
  Top 0.254: IC1.37 73.33,29.74 73.33,29.7 73.3,29.67 73.25,29.62 70.25,26.62 69.54,26.62 69.28,26.62 67.61,24.95 67.61,20.98 67.61,20.44 R39.2 R38.1
HOLD_T
  Top 0.254: J1.A24 68.24,14.36 70.29,16.41 70.29,17.58 R38.2
MUX_DAC_EN  (via drill 0.6)
  Top 0.254: IC21.15 60.79,46.4 60.5,46.69 59.02,46.69 v58.21,45.88
  Bottom 0.254: v58.21,45.88 59.28,44.81 61.26,42.83 61.26,33.23 60.24,32.21 60.24,30.64 60.52,30.36 62.07,28.81 62.07,22.56 61.36,21.85 61.36,16.49 61.35,16.48 61.35,15.6 63.16,13.79 J1.A20
MUX_DAC_SEL  (via drill 0.6)
  Top 0.406: IC21.1 58.05,40.03 v58.01,39.98
  Bottom 0.254: v58.01,39.98 58.21,39.78 58.21,32.06 61.66,28.6 61.66,23.02 60.9,22.25 60.9,17.83 60.9,15.03 60.94,14.99 61.89,14.04 J1.A19
MUX_REF_1  (via drill 0.6)
  Top 0.254: IC2.6 15.87,44.7 15.22,44.05 15.22,42.22 v16.65,40.8
  Bottom 0.254: v16.65,40.8 16.65,40.59 16.65,35.11 18.27,33.48 21.93,29.82 21.93,18.24 23.76,16.41 24.37,16.41 49.36,16.41 49.56,16.41 53.02,12.96 53.02,10.81 | 53.02,10.81 J1.A12 53.02,10.81
MUX_REF_2  (via drill 0.6)
  Top 0.254: IC3.6 15.72,25.65 15.52,25.65 15.43,25.55 15.43,23.32 15.43,22.51 v15.83,22.1
  Bottom 0.254: v15.83,22.1 16.04,21.9 16.44,21.9 16.85,21.49 20.51,17.83 23.15,15.19 23.96,15.19 47.13,15.19 47.74,15.19 47.94,15.19 50.38,12.75 50.46,12.67 50.46,12.06 J1.A10
MUX_REF_3  (via drill 0.6)
  Top 0.254: v16.44,8.69 17.51,9.76 17.51,11.59 17.7,11.78 IC4.6
  Bottom 0.254: J1.A6 45.38,12.06 44.89,12.55 44.69,12.75 21.73,12.75 21.52,12.55 17.66,8.69 v16.44,8.69
N$1
  Top 0.254: JP9.2 65.78,49.94 66.59,49.13 67.81,47.91 68.73,46.99 68.88,46.84 C37.1 C36.2
N$2
  Top 0.254: R9.2 36.7,2.76 J1.B1
N$3
  Top 0.254: JP10.1 70.86,45.06 70.46,44.67 70.26,44.47 C37.2
N$4
  Bottom 0.406: J1.A46 J1.A48
N$5
  Top 0.254: IC4.1 16.41,13.73 IC20.1
N$6
  Top 0.254: JP1.2 63.34,54.1 63.34,55.43 64.15,56.24 65.58,56.24 66.39,56.24 67.91,54.71 67.91,51.67 69.84,49.74 73.3,49.74 74.52,48.52 75.08,47.96 75.08,47.3 C38.1
N$7
  pour Top: 1.2,70.26 1.2,1.58 111.13,1.78 110.73,25.96 64.6,25.96 64.6,46.89 85.73,46.89 85.73,46.28 84.92,46.28 84.92,26.37 110.73,26.37 110.32,70.26
N$10
  Bottom 0.406: J1.B50 101.26,7.96 103.21,9.91 110.09,9.91 C42.1 111.91,9.72 R8.2
N$17
  Top 0.254: IC2.1 15.06,44.7 15.43,45.06 15.43,46.48 15.83,46.89 16.38,46.89 16.45,46.89 IC18.1
N$19
  Top 0.254: IC3.1 14.43,26.08 15.63,27.28 16.15,27.81 IC19.1
OP_MODE  (via drill 0.6)
  Top 0.254: IC1.11 73.83,36.97 v75.08,35.72
  Bottom 0.254: v75.08,35.72 75.48,35.31 75.58,35.21 75.58,31.35 77.36,29.57 77.57,29.36 77.57,29.26 77.57,21.34 77.97,20.93 77.97,19.31 R27.2 R26.1
OP_MODE_T
  Bottom 0.254: R26.2 79.69,17.53 79.69,15.49 80.94,14.23 J1.A34
OUT_S
  Top 0.254: IC1.35 72.33,29.71 72.23,29.62 71.22,28.6 70.4,27.79 69.64,27.79 65.58,27.79 63.75,25.96 62.43,24.64 61.77,23.98 61.77,19.61 62.07,19.31 R33.2 | 63.1,19.31 R33.2 | R33.2 62.78,19.36 | R32.1 62.85,19.2 R33.2
OUT_S_T
  Top 0.254: J1.A22 65.7,16.27 R32.2
POT_R1
  Top 0.254: R1.3 72.53,65.74 R1.2
  Top 0.406: TP27.TP 81.36,63.04 R1.2 75.07,61.62 72.53,59.08 70.85,59.08 JP4.3
POT_R2
  Top 0.254: R2.2 69.95,65.54 R2.1 | R2.2 67.45,60.5 | JP4.1 65.62,61.21 R2.2
  Top 0.406: TP28.TP 63.38,59.54 63.69,59.24 JP4.1
POT_R4
  Top 0.254: R4.2 10.96,42.78 | 10.96,42.78 12.53,42.78 13.19,43.44 14.39,43.44 IC2.3 | TP24.TP 11.57,42.17 10.96,42.78
POT_R5
  Top 0.254: R5.2 11.57,26.27 13.39,24.44 | 13.39,24.44 13.8,24.44 14.34,24.44 IC3.3 | TP25.TP 12.99,21.19 12.99,23.73 12.99,24.03 13.39,24.44
POT_R6
  Top 0.254: R6.2 13.19,9.76 13.19,9.1 14.31,7.98 | TP26.TP 14.31,7.98 | 14.31,7.98 14.31,9.1 15.68,10.47 16.4,10.47 IC4.3
REF_ADC  (via drill 0.6)
  Top 0.254: 57.8,28.79 U$5.P$2 | v83.61,21.49 82.8,21.49 81.86,22.43 81.86,25.28 81.86,25.53 82.09,25.76 82.68,25.76 C17.1 C18.1 | C24.1 55.61,31.6 C23.1 56.99,31.65 v57.2,31.45 57.04,31.6 57.04,32.46 56.38,33.12 51.66,33.12 50.49,31.96 48.41,29.87 TP17.TP
  Top 0.406: 57.8,28.79 57.8,29.82 57.55,30.08 57.2,30.43 v57.2,31.45 | IC22.P$2 84.1,28.08 82.59,26.57 82.59,25.85 C17.1 | v97.89,37.95 99.55,39.62 100.11,40.17 arc-45 100.33,40.27 100.57,40.27 | IC17.5 100.57,40.27 | C31.1 100.56,40.27 100.57,40.27
  Route3 0.406: v57.2,31.45 57.4,31.25 58.06,31.25 60.7,28.6 64.36,28.6 67,25.96 80.61,25.96 81.17,25.96 81.25,25.89 | v97.89,37.95 97.89,31.65 91.18,24.95 86.1,24.95 82.19,24.95 81.25,25.89 | 81.25,25.89 83.61,23.52 v83.61,21.49
REFIN_DAC
  Top 0.254: IC23.6 52.84,43.78 52.77,43.84
  Top 0.406: IC8.5 48.73,54.39 47.9,55.22 45.66,55.22 44.85,54.41 44.85,51.77 | 44.85,51.77 44.85,48.11 TP15.TP | 52.77,43.84 46.17,50.45 | 46.17,50.45 44.85,51.77 | C28.1 47.14,51.41 46.17,50.45
RES_BIAS_EXT
  Top 0.254: IC1.6 76.35,39.58 76.35,40.59 77.16,41.41 77.16,43.03 76.55,43.64 76.55,53.39 76.55,53.64 74.15,56.03 69.28,56.03 68.26,57.05 68.26,59.13 JP4.2
RST  (via drill 0.6)
  Top 0.254: IC1.38 73.83,28.37 v73.3,27.84
  Bottom 0.254: v73.3,27.84 73.25,27.89 71.22,27.89 69.3,25.97 68.68,25.35 68.68,24.25 R36.1 R37.2
RST_CSA  (via drill 0.6)
  Top 0.254: IC1.12 73.33,40.26 v74.26,41.2
  Bottom 0.254: v74.26,41.2 74.26,37.14 73.65,36.53 73.65,30.23 72.44,29.01 71.22,29.01 68.37,26.16 67.3,25.1 67.3,19.82 67.91,19.2 68.54,19.2 R29.2 | R28.1 R29.2 | R29.2 68.73,19.31 68.37,19.66
RST_CSA_T
  Bottom 0.254: R28.2 70.34,16.3 69.84,15.8 69.51,15.47 J1.A25
RST_T
  Bottom 0.254: R36.2 71.17,24.23 71.47,23.93 71.47,16.31 72.05,15.73 J1.A27
SDI_DAC  (via drill 0.6)
  Top 0.254: IC23.9 51.62,42.28 49.93,40.59 49.93,38.41 v49.88,38.36
  Bottom 0.254: v49.88,38.36 49.68,38.15 49.68,35.92 48.86,35.11 48.86,21.49 48.86,20.77 55.66,13.97 56.81,12.82 J1.A15
SDI_REF  (via drill 0.6)
  Top 0.254: v11.97,30.23 12.45,29.76 IC19.5 | IC18.5 12.24,48.86 v12.18,48.92 | IC20.5 12.85,15.74 11.97,16.61 v11.97,17.83
  Bottom 0.254: 12.18,30.03 v11.97,30.23 12.99,30.23 13.39,30.64 | v12.18,48.92 12.38,48.92 13.39,47.91 13.39,30.64 | 13.39,30.64 13.39,18.65 | 13.39,18.65 13.39,18.24 12.99,17.83 12.79,17.83 v11.97,17.83 | 44.69,13.36 44.48,13.36 | 44.48,13.36 14.01,13.36 13.39,13.97 13.39,18.65 | J1.A7 46.65,11.8 46.65,12.21 46.52,12.35 45.5,13.36 44.48,13.36
SDO_ADC1
  Top 0.254: IC22.P$8 89.84,28.08 94.43,28.08 94.84,27.67 94.84,17.18 94.57,16.92 | 94.57,16.92 92.24,14.58 | J1.A40 88.56,10.91 94.57,16.92
SDO_ADC2
  Top 0.254: U$5.P$8 57.84,18.21 57.84,17.81 57.84,11.04 J1.A16
SGN  (via drill 0.6)
  Top 0.254: IC1.39 74.33,32.17 v74.62,32.46
  Bottom 0.254: R35.2 R34.1 74.12,26.64 74.77,27.28 74.82,27.33 74.82,28.45 74.82,31.8 74.82,32.26 v74.62,32.46
SGN_T
  Bottom 0.254: R34.2 75.88,24.18 76.7,24.18 76.96,23.93 76.96,15.7 77.13,15.52 J1.A31
V0NDAC  (1 unrouted)
  Top 0.254: IC21.5 62.69,39.13 62.53,38.97 61.92,38.97 61.72,38.76 61.31,38.36 61.31,37.14 60.9,36.73 57.75,36.73 56.59,37.9 56.59,41.76 57.04,42.22 57.09,42.27 58.13,42.27 IC23.2
V0PDAC  (1 unrouted)
  Top 0.254: IC23.1 60.53,41.78 60.79,41.52 IC21.2
V1NDAC  (1 unrouted)
  Top 0.254: IC21.14 61.42,44.16 61.11,43.84 58.21,43.84 IC23.5
V1PDAC  (1 unrouted)
  Top 0.254: IC23.4 62.77,43.28 63.34,43.84 63.34,45.51 IC21.11
V_REF_PRECHAR  (via drill 0.6)  (1 unrouted)
  Top 0.254: IC1.7 75.83,42.1 v75.94,42.22 | v37.58,41.61 33.83,37.86 33.77,37.8
  Bottom 0.254: v75.94,42.22 75.94,44.25 74.72,45.47 63.75,45.47 62.73,46.48 62.33,46.89 57.04,46.89 56.03,45.88 56.03,45.06 56.03,43.64 54.4,42.01 44.44,42.01 37.98,42.01 v37.58,41.61
V_REF_PRECHAR_BUFF  (3 unrouted)
  Top 0.254: C34.1 32.7,37.91 C34.1 | 32.94,37.85 C34.1
VDD  (via drill 0.6)
  Top 0.254: IC22.P$4 86.3,26.13 86.3,24.55 86.98,23.88 C15.1 C16.1 85.9,21.17 v85.9,20.88 | IC18.2 16.47,47.55 16.42,47.5 | IC23.8 55.26,42.78 | C20.1 54.21,28.34 54.86,27.69 55.87,27.69 U$5.P$4 | C44.1 28.88,68.19 31.28,65.79 34.86,65.79 35.47,65.18
  Top 0.406: IC5.3 IC5.4 4.89,49.75 C3.1 3.25,49.75 1.81,48.31 1.81,34.5 | IC6.3 IC6.4 4.89,33.24 C1.1 3.91,33.28 3.03,33.28 1.81,34.5 | IC7.3 IC7.4 4.89,16.73 C2.1 | v35.09,65.84 35.47,65.46 35.47,65.18 35.47,64.57 | 35.47,64.57 IC11.3 | 1.81,34.5 1.81,17.83 2.83,16.82 3.85,16.82 C2.1 | IC2.5 17.46,44.05 18.07,44.66 18.07,45.67 | 18.07,45.67 18.07,46.69 17.26,47.5 17.2,47.55 17.15,47.55 IC18.2 | IC3.5 17.31,25 17.66,25.35 17.66,27.99 17.26,28.4 | IC4.5 19.19,11.13 19.39,11.13 20.15,11.89 20.15,13.31 20.15,13.92 19.29,14.79 | v19.69,46.89 19.29,46.89 18.07,45.67 | v19.69,29.01 18.68,29.01 18.07,28.4 17.26,28.4 | 19.29,14.79 18.98,14.48 18.94,14.44 17.4,14.44 IC20.2 | 19.29,14.79 19.49,14.99 v19.49,16.01 | v3.44,14.58 3.85,14.99 3.85,16.62 C2.1 | TP5.TP 36.53,65.64 35.47,64.57 | v52.32,30.03 52.32,29.36 52.32,28.49 C19.1 C20.1 | IC16.3 104.62,24.35 C25.1 105.95,24.74 106.83,24.74 107.64,25.55 v107.64,26.37 106.83,27.18 104.85,27.18 IC16.4 | C30.1 105.27,38.97 IC17.3 IC17.4 104.9,41.2 v105.4,41.2 | R1.1 80.24,68.24 v81.06,67.41 | IC8.4 52.84,54.24 53.76,54.24 53.99,54 53.99,53.08 C4.1 53.99,52.79 53.99,51.97 53.66,51.64 52.57,51.64 | IC8.3 52.57,51.64 | v53.38,49.53 53.38,50.82 52.57,51.64 | IC19.2 17.2,28.46 17.26,28.4 | 55.62,42.42 55.62,41 54.4,39.78 v53.38,39.78 | 55.62,42.42 55.62,43.44 | 55.62,43.44 55.62,46.17 55.62,46.24 arc-45 55.71,46.46 C39.2 | 55.26,42.78 55.62,42.42 | IC21.16 60.15,45.33 59.28,44.45 56.64,44.45 55.62,43.44
  pour Route3: 0.9,71.12 0.89,1.09 114.05,0.99 113.98,18.53 114.01,71
VDD2  (via drill 0.6)
  Top 0.254: C46.1 52.45,66.67 TP6.TP
  Top 0.406: TP6.TP 53.43,65.59 51.39,65.59 49.44,63.63 IC9.3 51.8,62.54 v52.82,61.52 | 82.8,52.62 IC10.3 IC13.4 | 82.8,52.62 IC10.4 80.21,53.8 v78.99,53.8 | C5.1 82.8,49.67 82.8,52.62 | C7.1 90.94,53.27 IC13.4 | IC13.3 IC13.4
  Route3 0.406: v52.82,61.52 54.85,61.52 58.3,61.52 62.16,57.66 62.57,57.25 68.02,57.25 71.47,53.8 v78.99,53.8
VDD_REF_1
  Top 0.254: IC5.5 8.55,49.1 10.14,47.5 14.11,47.5 IC18.7 | R4.1 6.5,45.28 7.3,46.08 7.3,48.96 IC5.5 | IC5.5 8.09,49.75 10.1,49.75 C26.1
VDD_REF_2
  Top 0.254: 7.44,31.3 IC6.5 9.12,32.59 C27.1 | 7.44,31.3 7.44,30.26 5.88,28.7 3.95,28.7 R5.1 | IC19.7 11.21,28.46 9.13,30.53 8.2,30.53 7.44,31.3
VDD_REF_3
  Top 0.254: 7.5,14.99 7.5,14.38 7.5,13.62 R6.1 | 7.5,14.99 7.5,16.01 IC7.5 | IC20.7 12.93,14.44 10.8,14.44 | 10.8,14.44 8.19,14.44 arc-45 7.96,14.53 7.5,14.99 | C35.1 9.99,15.38 arc45 10.09,15.15 10.8,14.44
VDD_SUPPLY_1
  Top 0.254: C43.1 26.81,63.55 25.79,62.54
  Top 0.406: 21.52,62.54 19.9,62.54 19.29,62.54 17.51,64.32 JP5.1 | 21.52,62.54 24.98,62.54 25.79,62.54 IC11.1 | TP1.TP 23,64.01 21.52,62.54
VDD_SUPPLY_2
  Top 0.254: C45.1 42.01,62.58 43.43,61.15
  Top 0.406: 23.96,61.32 20.3,61.32 19.09,61.32 17.51,59.74 JP8.1 | 23.96,61.32 26.81,61.32 29.04,59.08 41.36,59.08 43.43,61.15 IC9.1 44.64,62.36 44.64,62.13 | TP3.TP 23,60.35 23.96,61.32
VDD_SUPPLY_IN_1  (via drill 0.6)
  Top 0.406: JP3.3 8.47,63.81 TP2.TP 14.56,65.64 JP5.2 | IC12.8 31.64,16.78 33.11,18.24 v33.11,18.85 | IC14.8 28.9,34.44 v30.26,33.07
  Route3 0.406: JP5.2 14.97,63.4 16.44,61.93 24.57,61.93 28.84,57.66 28.84,36.12 | 28.84,36.12 28.84,22.1 29.65,21.29 32.29,21.29 33.11,20.48 v33.11,18.85 | v30.26,33.07 30.26,34.7 28.84,36.12
VDD_SUPPLY_IN_2
  Top 0.406: 10.96,61.42 4.35,61.42 3.03,61.42 JP3.2 | 10.96,61.42 11.87,61.42 12.43,61.42 JP8.2 | TP4.TP 10.3,60.76 10.96,61.42
VI+_FIL
  Top 0.254: JP11.2 70.86,41.41 70.05,40.59 68.83,40.59 68.02,39.78 68.02,38.36 69.97,36.41 IC1.22
VI+_FIL_DAC  (1 unrouted)
  Top 0.254: JP11.1 66.75,42.37 66.39,42.01 62.53,42.01 62.12,41.61 62.12,40.09 IC21.4
VI-_FIL
  Top 0.254: IC1.23 68.43,35.91 JP12.2
VI-_FIL_DAC  (1 unrouted)
  Top 0.254: IC21.7 63.96,37.84 JP12.1
VICM  (via drill 0.6)  (2 unrouted)
  Top 0.254: IC1.40 74.83,31.4 75.28,31.85 76.09,31.85 v76.7,32.46 | IC21.6 63.34,40.01 63.34,38.56 62.58,37.8 v62.33,37.8 | IC21.3 61.42,39.4 61.42,39.28 60.9,38.76 60.09,38.76 59.89,38.56 v59.89,37.95 | 37.32,24.84 37.32,28.15 | 37.32,28.15 37.32,33.23 v37.83,33.73 | v37.83,33.73 38.21,34.11 v37.83,33.73 | TP12.TP 36.66,28.81 37.32,28.15 | 33.4,24.23 C32.1 35.39,22.91
  Route3 0.254: v76.7,32.46 75.94,31.7 75.94,29.62 75.74,29.82 71.27,29.82 70.45,30.64 69.84,31.25 69.23,31.25 66.44,34.04 66.19,34.29 61.82,34.29 | v62.33,37.8 62.33,35.51 62.33,34.8 61.82,34.29 | 59.33,34.29 40.52,34.29 38.39,34.29 v37.83,33.73 | 59.33,34.29 61.82,34.29 | v59.89,37.95 59.89,34.85 59.33,34.29
VICM_BUFF  (2 unrouted)
VICM_MUX  (2 unrouted)
  Top 0.254: IC12.3 27.65,22.33 26.4,23.57 25.63,24.35 22.54,24.35 | IC3.4 22.54,24.35 | TP11.TP 25.23,27.04 22.54,24.35
VIN_CSA
  Top 0.254: IC1.15 71.83,41 71.83,41.35 73.09,42.62 73.76,43.28 73.76,47.09 JP10.2 73.4,48.41 72.89,48.92 69.44,48.92 67,51.36 67,52.48 JP1.3 63.95,52.17 62.53,52.17 61.82,52.89 61.82,55.43 61.82,56.18 59.93,58.07 53.53,58.07 TP20.TP
VIN_CSA_1  (1 unrouted)
  Top 0.254: 64.6,48.31 64.6,46.27 64.6,46.08 IC21.9 | 64.6,48.31 64.6,48.63 JP9.1 | 64.6,48.31 66.39,46.52 66.39,45.06 66.39,44.71 66.64,44.45 67.34,44.45 C36.1 67.45,44.66
VL_ADC  (via drill 0.6)
  Top 0.254: U$5.P$7 56.03,23.95 56.03,22.09 C22.1 C21.1
  Top 0.406: v56.59,18.44 57.2,19.05 57.2,21.49 56.74,21.95 56.16,21.95 C22.1 | v93.82,23.32 93.82,26.57 93.26,27.13 92.79,27.13 C8.1 92.7,27.12 C14.1 91.17,27.18 IC22.P$7 | TP16.TP 102.05,26.31 IC16.5 101.13,26.3 100.6,26.3 arc45 100.38,26.2 C29.1 100.02,25.85 arc-45 99.8,25.76 v98.29,25.76
  Route3 0.406: v98.29,25.76 95.85,23.32 v93.82,23.32 91.69,21.19 86.56,16.06 85.29,16.06 57.91,16.06 56.59,17.38 v56.59,18.44
VO+_BP_FIL
  Top 0.254: IC1.24 66.23,35.41 52.01,35.41 50.9,34.29 45.46,34.29 43.73,36.02 JP13.1
VO+_BP_FIL_TEST
  Top 0.254: JP13.2 45,38.56 TP22.TP
VO+_CH
  Top 0.254: IC22.P$12 86.3,30.06 86.3,30.84 85.69,31.45 82.19,31.45 82.04,31.45 81.98,31.45 81.53,31.91 79.43,31.91 IC1.50
VO+_FIL
  Top 0.254: IC1.30 70.52,32.41 69.69,32.41 68.98,31.7 68.98,31.65 68.98,30.99 68.42,30.43 68.42,29.62 67.81,29.01 62.33,29.01 61.11,27.79 59.87,27.79 U$5.P$12
VO-_BP_FIL
  Top 0.254: IC1.25 66.34,34.91 52.58,34.91 50.34,32.67 46.68,32.67 45.46,31.45 45.46,26.16 JP14.1
VO-_BP_FIL_TEST
  Top 0.254: JP14.2 42.92,27.94 TP23.TP
VO-_CH  (via drill 0.6)
  Top 0.254: v81.38,30.64 84.27,30.64 84.88,30.03 84.88,29.38 IC22.P$1 | v83,32.67 82.59,32.67 82.39,32.87 79.51,32.87 IC1.52
  Bottom 0.254: v83,32.67 83,32.26 v81.38,30.64
VO-_FIL  (via drill 0.6)
  Top 0.254: IC1.31 71.67,31.91 v72.23,32.46 | v61.66,30.84 60.82,30.84 U$5.P$1
  Bottom 0.254: v61.66,30.84 62.68,30.84 63.29,31.45 69.59,31.45 70,31.85 71.62,31.85 v72.23,32.46
VOCM  (via drill 0.6)  (2 unrouted)
  Top 0.254: IC1.36 72.83,31.31 72.64,31.5 71.98,31.5 71.83,31.35 71.83,30.84 71.83,30.74 | 71.83,30.74 71.83,30.03 71.83,29.98 71.06,29.21 70.25,28.4 68.62,28.4 68.02,28.4 63.75,28.4 62.33,26.98 61.11,25.76 61.11,24.54 60.9,24.34 v60.7,24.34 | v50.95,22.51 50.74,22.3 46.72,22.3 39.29,14.87 | 30,12.96 C33.1 | IC1.34 71.83,30.74 | 39.29,14.87 38.59,14.87 37.63,15.84 TP14.TP | 31.89,13.36 37.78,13.36 39.29,14.87 | 30.15,14.38 30.15,12.96 C33.1 | C33.1 30.15,12.87 30.46,12.55 31.07,12.55 31.43,12.91
  Top 0.406: C33.1 30.15,12.96
  Bottom 0.254: v50.95,22.51 52.37,22.51 53.38,23.52 59.89,23.52 v60.7,24.34
VOCM_1  (3 unrouted)
  Top 0.254: IC2.4 23.76,43.4 | 23.76,43.4 25.37,43.4 | IC14.3 27.6,41.17 27.42,41.35 | TP30.TP 25.38,45.02 23.76,43.4
VOCM_BUFF  (2 unrouted)
VOCM_MUX  (2 unrouted)
  Top 0.254: IC4.4 24.73,10.48 25.59,11.33 | 25.59,11.33 26.91,12.65 27,12.74 IC12.5 | TP13.TP 26.91,10.01 25.59,11.33
VOUT_CSA
  Top 0.254: IC1.54 79.5,33.89 TP9.TP
(copper drawn outside any net)
  shapes: Bottom area x2

## Text on the board
tNames: TP2 | JP5 | TP1 | TP5 | TP6 | JP3 | TP28 | TP27 | 5V | VDD_IN1 | VDD_1 | VDD | VDD2 | 3.3V | TP4 | JP8 | TP3 | POT_R2 | 1 | POT_R1 | TP20 | GND | R7 | VDD_IN2 | VDD_2 | Vin_csa | TP29 | DGND | R3 | JP4 | TP19 | 3.3V | JP1 | 1.8V | C7 | TP18 | C4 | IC5 | AGND | GND | TP21 | IC10 | C28 | C26 | 1 | TP15 | C5 | IC13 | 1.8V | IC-UC | WAC-07 / 03/2014 | C3 | IC8 | V_ref_prechar | TP30 | C39 | 1.8V | JP9 | C37 | IC18 | C40 | REFIN_DAC | JP10 | C41 | Vref_mux | C36 | TP8 | TP7 | IC12 | C38 | AVDD | R12 | DVDD | IC17 | JP11 | TP24 | C6 | TP10 | C31 | TP22 | IC6 | IC1 | baseline | C30 | 3.3V | POT_R4 | C34 | JP13 | JP12 | C10 | C9 | TP9 | vo+_bp_fil | C23 | C1 | C24 | C11 | THE / BEAN2 | TP16 | C27 | IC22 | Vout_csa | 1.8V | TP11 | TP12 | TP23 | TP17 | VL_ADC | C14 | C8 | 3.3V | IC19 | Vicm | VREF / ADC | C13 | C12 | C17 | C18 | Vicm_mux | vo-_bp_fil | IC23 | R10 | C32 | R14 | R18 | R22 | C29 | TP25 | C20 | R15 | R19 | JP14 | R23 | C25 | TP14 | C19 | C15 | IC16 | IC7 | R33 | R39 | R17 | C16 | POT_R5 | C22 | R25 | R32 | R38 | R16 | Vocm | R20 | R24 | C2 | C21 | C35 | R11 | 1.8V | IC20 | C33 | TP13 | Vocm_mux | TP26 | POT_R6 | R9
bNames: R43 | R36 | R34 | R42 | R37 | R35 | R31 | R29 | R41 | R30 | R28 | R40 | R26 | C42 | R8